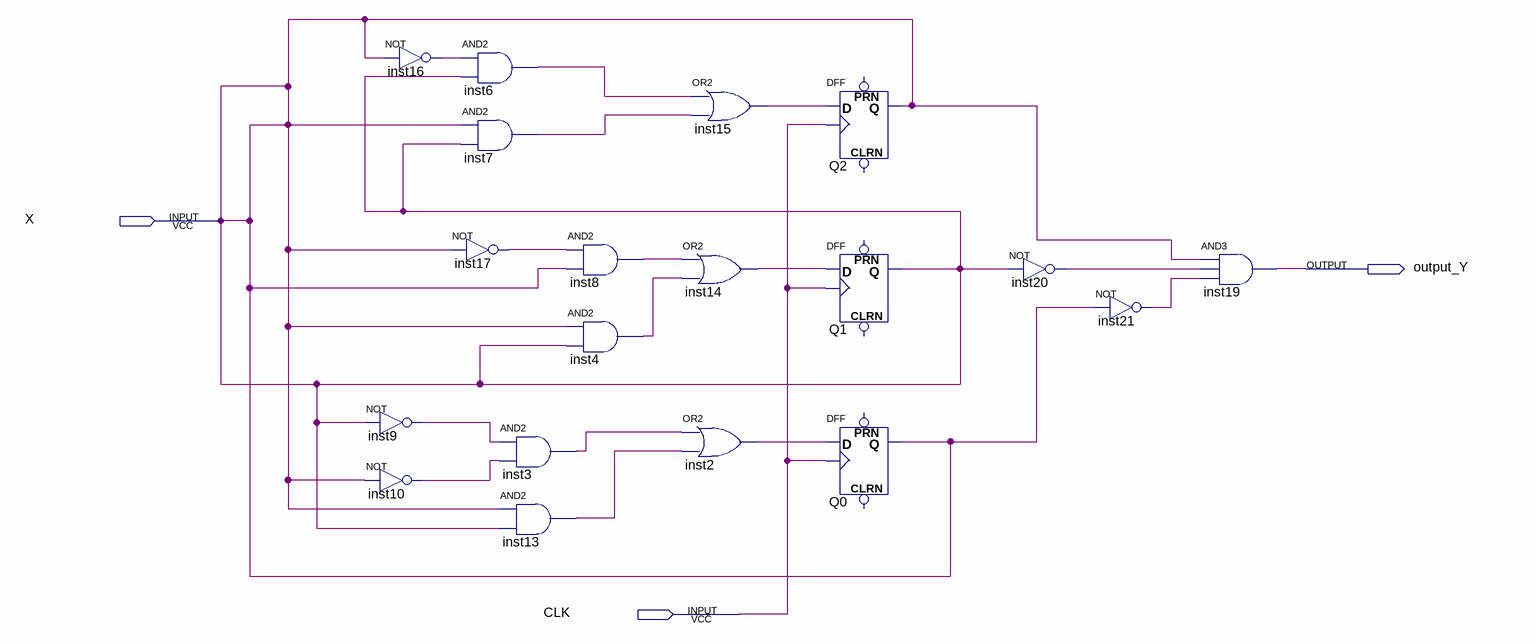
[diagram p0: schematic sheet]
// Quartus schematic MEF7.bdf as structural Verilog: 19 symbols, 3 pins
module MEF7 (
  input  X,
  input  CLK,
  output output_Y
);

  wire inst2_out, inst3_out, inst4_out, inst6_out, inst7_out, inst8_out, inst9_out, inst10_out, inst13_out,
       inst14_out, inst15_out, inst16_out, inst17_out, inst20_out, inst21_out;

  not inst16 (inst16_out, X);
  not inst9 (inst9_out, X);
  not inst10 (inst10_out, X);
  and inst6 (inst6_out, inst16_out, X);
  and inst7 (inst7_out, X, X);
  not inst17 (inst17_out, X);
  and inst3 (inst3_out, inst9_out, inst10_out);
  and inst13 (inst13_out, X, X);
  and inst8 (inst8_out, inst17_out, X);
  and inst4 (inst4_out, X, X);
  or inst15 (inst15_out, inst6_out, inst7_out);
  or inst14 (inst14_out, inst8_out, inst4_out);
  or inst2 (inst2_out, inst3_out, inst13_out);
  DFF Q2 (.CLK(CLK), .D(inst15_out), .Q(X));  // open: CLRN, PRN
  DFF Q1 (.CLK(CLK), .D(inst14_out), .Q(X));  // open: CLRN, PRN
  DFF Q0 (.CLK(CLK), .D(inst2_out), .Q(X));  // open: CLRN, PRN
  not inst20 (inst20_out, X);
  not inst21 (inst21_out, X);
  and inst19 (output_Y, X, inst20_out, inst21_out);
endmodule
